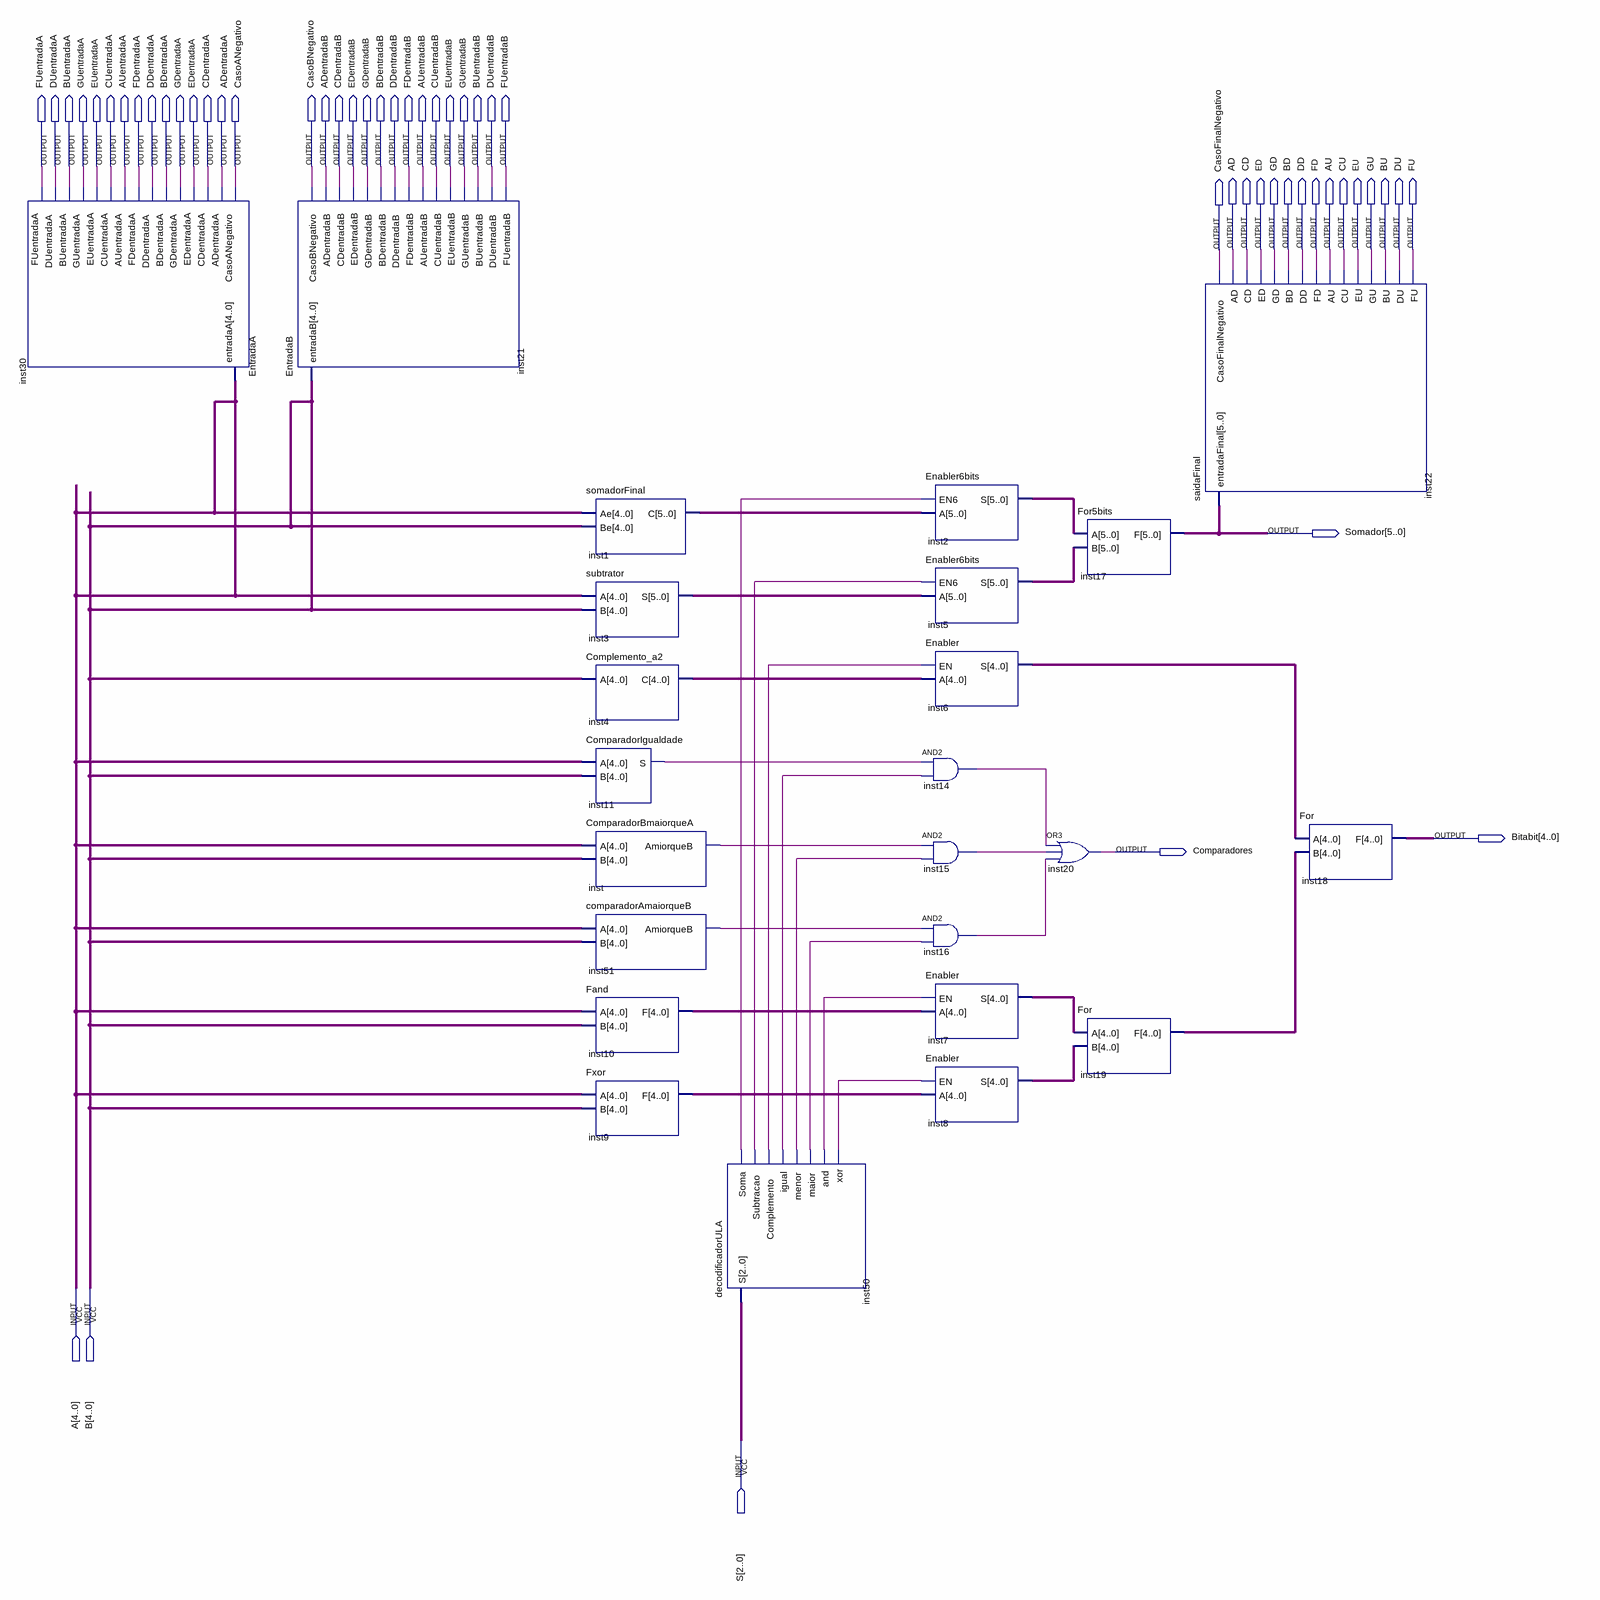
[diagram p0: schematic sheet]
// Quartus schematic ULA.bdf as structural Verilog: 24 symbols, 51 pins
module ULA (
  input  [4:0] A,
  input  [4:0] B,
  input  [2:0] S,
  output FUentradaA,
  output DUentradaA,
  output BUentradaA,
  output GUentradaA,
  output EUentradaA,
  output CUentradaA,
  output AUentradaA,
  output FDentradaA,
  output DDentradaA,
  output BDentradaA,
  output GDentradaA,
  output EDentradaA,
  output CDentradaA,
  output ADentradaA,
  output CasoANegativo,
  output CasoBNegativo,
  output ADentradaB,
  output CDentradaB,
  output EDentradaB,
  output GDentradaB,
  output BDentradaB,
  output DDentradaB,
  output FDentradaB,
  output AUentradaB,
  output CUentradaB,
  output EUentradaB,
  output GUentradaB,
  output BUentradaB,
  output DUentradaB,
  output FUentradaB,
  output CasoFinalNegativo,
  output AD,
  output CD,
  output ED,
  output GD,
  output BD,
  output DD,
  output FD,
  output AU,
  output CU,
  output EU,
  output GU,
  output BU,
  output DU,
  output FU,
  output [5:0] Somador,
  output [4:0] Bitabit,
  output Comparadores
);

  wire inst11_s, inst14_out, inst15_out, inst16_out, inst50_and, inst50_complemento, inst50_igual,
       inst50_maior, inst50_menor, inst50_soma, inst50_subtracao, inst50_xor, inst51_amiorqueb,
       inst_amiorqueb;
  wire [4:0] inst4_c, inst6_s, inst7_s, inst8_s, inst9_f, inst10_f, inst19_f;
  wire [5:0] inst1_c, inst2_s, inst3_s, inst5_s;

  EntradaA inst30 (
    .entradaA(A), .CasoANegativo(CasoANegativo), .ADentradaA(ADentradaA), .CDentradaA(CDentradaA),
    .EDentradaA(EDentradaA), .GDentradaA(GDentradaA), .BDentradaA(BDentradaA), .DDentradaA(DDentradaA),
    .FDentradaA(FDentradaA), .AUentradaA(AUentradaA), .CUentradaA(CUentradaA), .EUentradaA(EUentradaA),
    .GUentradaA(GUentradaA), .BUentradaA(BUentradaA), .DUentradaA(DUentradaA), .FUentradaA(FUentradaA));
  EntradaB inst21 (
    .entradaB(B), .CasoBNegativo(CasoBNegativo), .ADentradaB(ADentradaB), .CDentradaB(CDentradaB),
    .EDentradaB(EDentradaB), .GDentradaB(GDentradaB), .BDentradaB(BDentradaB), .DDentradaB(DDentradaB),
    .FDentradaB(FDentradaB), .AUentradaB(AUentradaB), .CUentradaB(CUentradaB), .EUentradaB(EUentradaB),
    .GUentradaB(GUentradaB), .BUentradaB(BUentradaB), .DUentradaB(DUentradaB), .FUentradaB(FUentradaB));
  somadorFinal inst1 (.Ae(A), .Be(B), .C(inst1_c));
  subtrator inst3 (.A(A), .B(B), .S(inst3_s));
  Complemento_a2 inst4 (.A(B), .C(inst4_c));
  ComparadorIgualdade inst11 (.A(A), .B(B), .S(inst11_s));
  ComparadorBmaiorqueA inst (.A(A), .B(B), .AmiorqueB(inst_amiorqueb));
  comparadorAmaiorqueB inst51 (.A(A), .B(B), .AmiorqueB(inst51_amiorqueb));
  Fand inst10 (.A(A), .B(B), .F(inst10_f));
  Fxor inst9 (.A(A), .B(B), .F(inst9_f));
  decodificadorULA inst50 (
    .S(S), .Soma(inst50_soma), .Subtracao(inst50_subtracao), .Complemento(inst50_complemento),
    .igual(inst50_igual), .menor(inst50_menor), .maior(inst50_maior), .\and (inst50_and), .\xor (inst50_xor));
  Enabler6bits inst2 (.EN6(inst50_soma), .A(inst1_c), .S(inst2_s));
  Enabler6bits inst5 (.EN6(inst50_subtracao), .A(inst3_s), .S(inst5_s));
  Enabler inst6 (.EN(inst50_complemento), .A(inst4_c), .S(inst6_s));
  and inst14 (inst14_out, inst11_s, inst50_igual);
  and inst15 (inst15_out, inst_amiorqueb, inst50_menor);
  and inst16 (inst16_out, inst51_amiorqueb, inst50_maior);
  Enabler inst7 (.EN(inst50_and), .A(inst10_f), .S(inst7_s));
  Enabler inst8 (.EN(inst50_xor), .A(inst9_f), .S(inst8_s));
  or inst20 (Comparadores, inst14_out, inst15_out, inst16_out);
  For5bits inst17 (.A(inst2_s), .B(inst5_s), .F(Somador));
  For inst19 (.A(inst7_s), .B(inst8_s), .F(inst19_f));
  saidaFinal inst22 (
    .entradaFinal(Somador), .CasoFinalNegativo(CasoFinalNegativo), .AD(AD), .CD(CD), .ED(ED), .GD(GD),
    .BD(BD), .DD(DD), .FD(FD), .AU(AU), .CU(CU), .EU(EU), .GU(GU), .BU(BU), .DU(DU), .FU(FU));
  For inst18 (.A(inst6_s), .B(inst19_f), .F(Bitabit));
endmodule
